# EAGLE design riffle-CTL-0.2-dip (EAGLE 7.3.0)
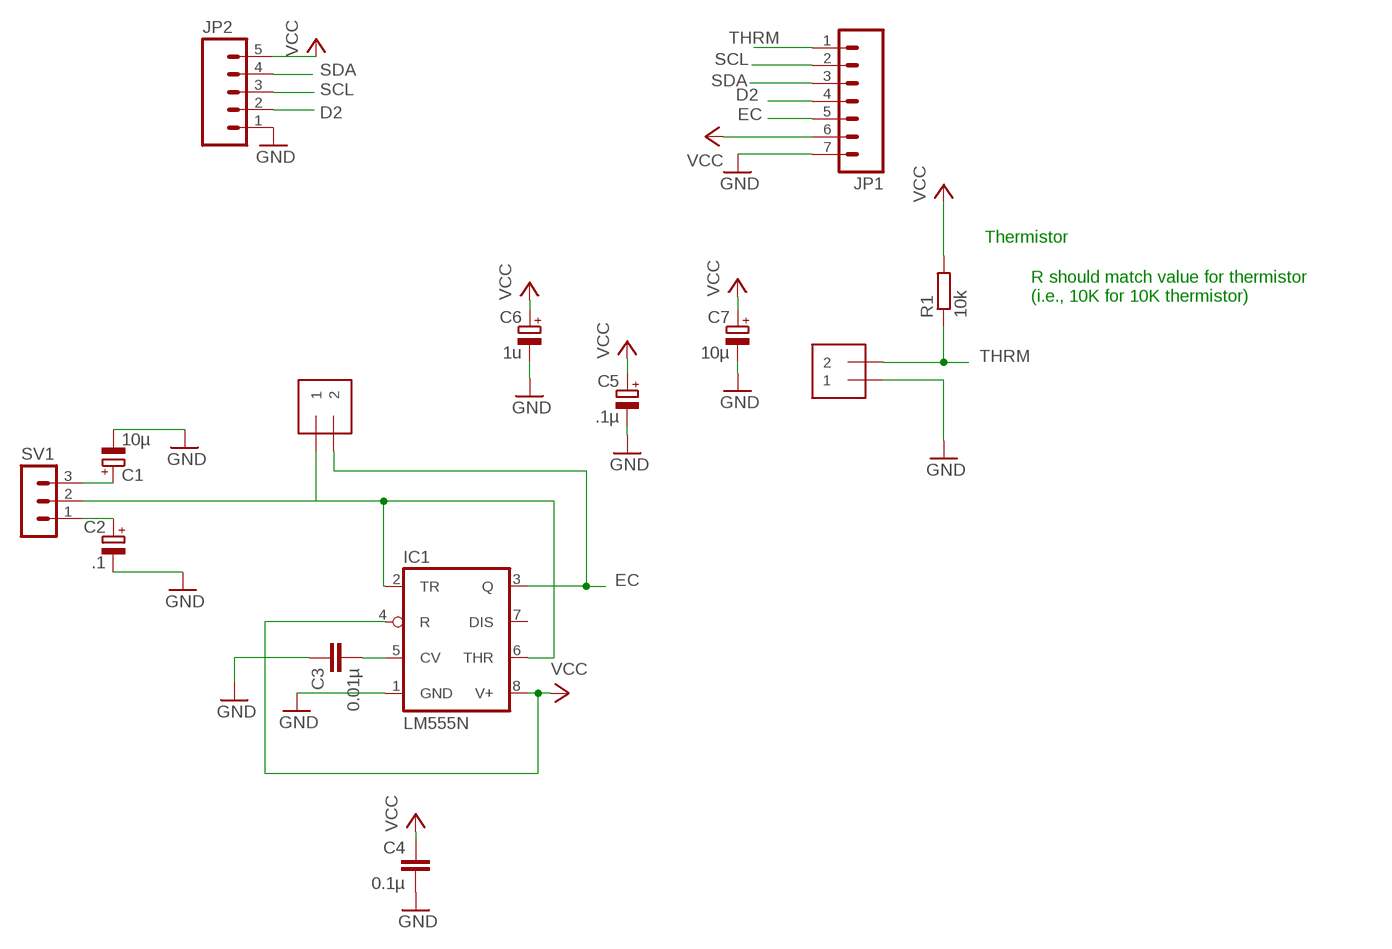
[diagram p0: schematic, sheet 1]

## Parts
C1  10µ  CPOL-EUE1.8-4  [E1,8-4]
C2  .1  CPOL-EUE1.8-4  [E1,8-4]
C3  0.01µ  C-EU025-024X044  [C025-024X044]
C4  0.1µ  C-EU025-024X044  [C025-024X044]
C5  .1µ  CPOL-EUE1.8-4  [E1,8-4]
C6  1u  CPOL-EUE1.8-4  [E1,8-4]
C7  10µ  CPOL-EUE1.8-4  [E1,8-4]
EC1  1X2-3.5MM  [1X2-3.5MM]
IC1  LM555N  [DIL08]
JP1  M07  [1X07]
JP2  M05PTH  [1X05]
R1  10k  R-EU_0204/7  [0204/7]
SV1  MA03-1  [MA03-1]
THRM  1X2-3.5MM  [1X2-3.5MM]

## Nets
D2: JP1.4 JP2.2
EC: EC1.2 IC1.3(Q) JP1.5
GND: C1.- C2.- C3.1 C4.2 C5.- C6.- C7.- IC1.1(GND) JP1.7 JP2.1 THRM.1
N$1: C1.+ SV1.3
N$3: EC1.1 IC1.2(TR) IC1.6(THR) SV1.2
N$4: C2.+ SV1.1
N$7: C3.2 IC1.5(CV)
SCL: JP1.2 JP2.3
SDA: JP1.3 JP2.4
THRM: JP1.1 R1.1 THRM.2
VCC: C4.1 C5.+ C6.+ C7.+ IC1.4(R) IC1.8(V+) JP1.6 JP2.5 R1.2
Unconnected: IC1.7(DIS)

## Notes on the sheet
- Thermistor
- R should match value for thermistor
  (i.e., 10K for 10K thermistor)

## Library data of the parts
C1 C2 C5-C7 = resistor:CPOL-EU: POLARIZED CAPACITOR, European symbol
C3 C4 = resistor:C-EU: CAPACITOR, European symbol
EC1 THRM = adafruit:1X2: 3.5mm Terminal block http://www.ladyada.net/library/pcb/eaglelibrary.html
IC1 = linear:*555: TIMER
JP1 = SparkFun-Connectors:M07: Header 7 Standard 7-pin 0.1" header. Use with straight break away headers (SKU : PRT-00116), right angle break away headers (PRT-00553), swiss pins (PRT-00743), machine pins (PRT-00117), and female headers (PRT-00115). NOTES ON THE VARIANTS LOCK and LOCK_LONGPADS... This footprint was designed to help hold the alignment of a through-hole component (i.e. 7-pin header) while soldering it into place. You may notice that each hole has been shifted either up or down by 0.005 of an inch from it's more standard position (which is usually a perfectly straight line). This slight alteration caused the pins (the squares in the middle) to touch the edges of the holes. Because they are alternating, it causes a "brace" to hold the header in place. 0.005 has proven to be the perfect amount of "off-center" position when using our standard breakaway headers. Although looks a little odd when you look at the bare footprint, once you have a header in there, the alteration is very hard to notice. Also, if you push a header all the way into place, it is covered up entirely on the bottom side. This idea of altering the position of holes to aid alignment will be further integrated into the Sparkfun Library for other footprints. It can help hold any component with 3 or more connection pins.
JP2 = SparkFun-Connectors:M05: Header 5 Standard 5-pin 0.1" header. Use with straight break away headers (SKU : PRT-00116), right angle break away headers (PRT-00553), swiss pins (PRT-00743), machine pins (PRT-00117), and female headers (PRT-00115). Molex polarized connector foot print use with SKU : PRT-08230 with associated crimp pins and housings.
R1 = resistor:R-EU_: RESISTOR, European symbol
SV1 = con-lstb:MA03-1: PIN HEADER; OC_FARNELL: unknown; OC_NEWARK: unknown

## Net classes
0 default: width 0.203 mm, drill 0.33 mm, clearance 0.203 mm
1 power: width 0.381 mm, clearance 0.254 mm

## Board
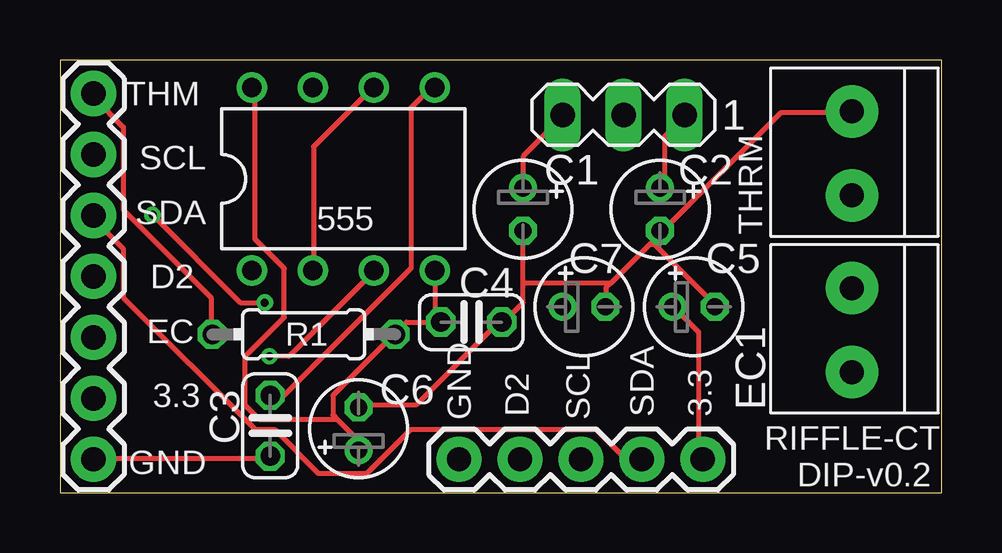
[diagram p1: board, top side]
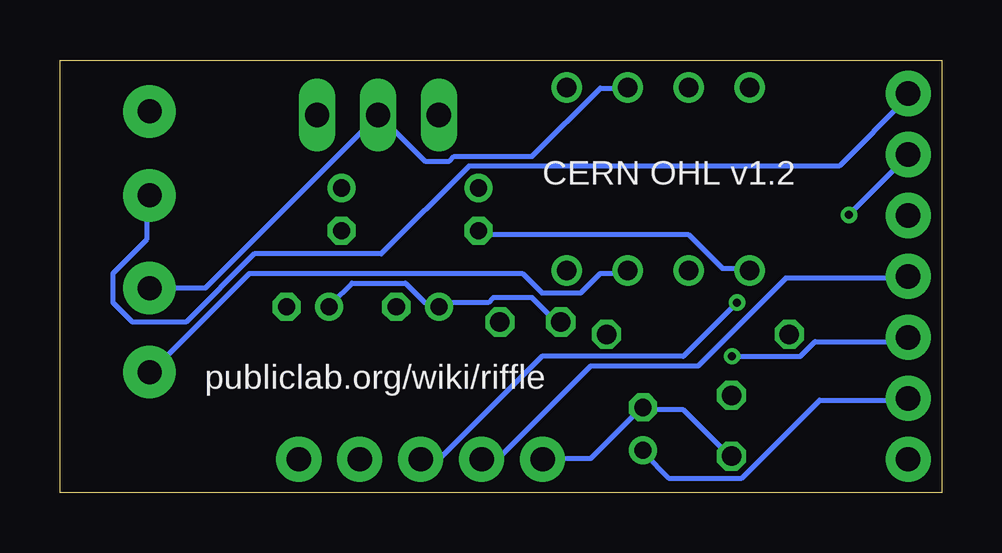
[diagram p2: board, bottom side, seen from below]

Size 36.75 x 18.02 mm. Coordinates in mm from the lower left corner, seen from the top.
Outline: 0,0 36.75,0 36.75,18.02 0,18.02 0,0
Copper layers (1*16): Top 0.0356mm / dielectric 1.5011mm / Bottom 0.0356mm
Design rules "LaenPCBOrder": minimum track width 6mil, minimum drill 13mil, track to track 6mil, track to pad 6mil, pad to pad 6mil, via to via 6mil, smd to smd 6mil, copper to edge 15mil, drill to drill 6mil, minimum pad ring 7mil, minimum via ring 7mil, stop-mask expansion 3mil, vias tented up to drill 0mil, thermal gap 10mil

### Footprints (pad centres in the part's own frame; a part is rotated, then mirrored left to right if it is on the bottom)
E1,8-4 = drill 0.711 pad 1.168: + -0.889,0 | drill 0.711 pad 1.168 octagon: - 0.889,0
C025-024X044 = drill 0.813 octagon: 1 -1.27,0; 2 1.27,0
1X2-3.5MM = drill 1 pad 2.184: 1 1.8,0; 2 -1.7,0
DIL08 = drill 0.813 pad 1.27: 1 -3.81,-3.81; 2 -1.27,-3.81; 3 1.27,-3.81; 4 3.81,-3.81; 5 3.81,3.81; 6 1.27,3.81; 7 -1.27,3.81; 8 -3.81,3.81
1X07 = drill 1.016 pad 1.88: 1 0,0; 2 2.54,0; 3 5.08,0; 4 7.62,0; 5 10.16,0; 6 12.7,0; 7 15.24,0
1X05 = drill 1.016 pad 1.88: 1 0,0; 2 2.54,0; 3 5.08,0; 4 7.62,0; 5 10.16,0
0204/7 = drill 0.813 octagon: 1 -3.81,0; 2 3.81,0
MA03-1 = drill 1.016 long: 1 -2.54,0; 2 0,0; 3 2.54,0

### Placement (x,y rotation side)
C1  19.3,11.81 270 top
C2  25.02,11.81 270 top
C3  8.76,2.79 90 top
C4  17.14,7.11 0 top
C5  26.42,7.75 0 top
C6  12.45,2.67 90 top
C7  21.84,7.75 0 top
EC1  33.02,6.73 90 top
IC1  11.81,13.08 0 top
JP1  1.4,16.64 270 top
JP2  16.64,1.4 0 top
R1  10.16,6.6 0 top
SV1  23.5,15.75 180 top
THRM  33.02,14.1 90 top

### Tracks (layer width: path | path; a pad name or v marks a point on that pad's centre or on a via)
D2
  Bottom 0.203: JP2.2 19.1,1.42 18.49,1.42 14.63,5.28 10.16,5.28 6.5,8.94 1.42,8.94 JP1.4
EC  (via drill 0.33)
  Top 0.203: v8.74,5.69 9.55,5.69 13.01,9.14 IC1.3
  Bottom 0.203: IC1.3 13.21,9.14 14.22,9.14 15.04,8.33 16.66,8.33 17.48,9.14 28.85,9.14 32.92,5.08 EC1.2 | v8.74,5.69 5.89,5.69 5.28,6.3 1.42,6.3 JP1.5
GND
  Top 0.203: JP1.7 1.42,1.42 8.74,1.42 C3.1 | 19.3,8.74 19.3,7.92 18.49,7.11 C4.2 18.29,7.11 14.83,3.66 12.6,3.66 C6.- | 19.3,8.74 C1.- | 24.59,10.36 24.99,10.77 C2.- 25.2,10.97 30.07,15.85 32.92,15.85 THRM.1 | 24.59,10.36 22.96,8.74 | 22.96,8.74 22.76,8.53 22.76,7.92 C7.- | 24.59,10.36 24.79,10.36 27.23,7.92 C5.- | 22.96,8.74 19.3,8.74
  Bottom 0.203: C3.1 8.94,1.63 10.77,3.45 12.39,3.45 C6.- 12.6,3.45 14.63,1.42 16.46,1.42 JP2.1 | IC1.1 8.13,9.35 9.14,9.35 10.57,10.77 19.3,10.77 C1.-
N$1
  Top 0.203: C1.+ 19.3,14.02 20.93,15.65 SV1.3
N$3
  Top 0.203: IC1.2 10.57,9.35 10.57,14.43 13.01,16.87 IC1.6
  Bottom 0.203: EC1.1 32.92,8.53 30.68,8.53 23.57,15.65 SV1.2 23.37,15.65 21.54,13.82 20.52,13.82 20.32,14.02 17.07,14.02 14.22,16.87 13.21,16.87 IC1.6
N$4
  Top 0.203: C2.+ 25.2,12.8 25.2,14.83 26.01,15.65 SV1.1
N$7
  Top 0.203: C3.2 9.35,4.06 14.63,9.35 14.63,16.05 15.44,16.87 IC1.5
SCL  (via drill 0.33)
  Top 0.203: v8.53,7.92 7.52,7.92 v3.86,11.58
  Bottom 0.203: v8.53,7.92 10.77,5.69 16.66,5.69 20.93,1.42 21.54,1.42 JP2.3 | v3.86,11.58 1.42,14.02 JP1.2
SDA
  Top 0.203: JP2.4 24.18,1.42 23.57,1.42 22.35,2.64 14.63,2.64 12.8,0.81 10.77,0.81 8.94,2.64 8.13,2.64 2.64,8.13 2.64,10.16 1.42,11.38 JP1.3
THRM
  Top 0.203: R1.1 6.3,6.71 6.3,8.13 2.64,11.79 2.64,15.24 1.42,16.46 JP1.1
  Bottom 0.203: THRM.2 33.12,12.39 33.12,10.57 34.54,9.14 34.54,7.92 33.73,7.11 31.5,7.11 28.65,9.96 23.37,9.96 19.71,13.61 4.27,13.61 1.42,16.46 JP1.1
VCC
  Top 0.203: JP2.5 26.62,1.42 26.62,6.71 25.6,7.72 C5.+ | 11.58,3.05 11.38,3.25 11.38,4.06 13.82,6.5 R1.2 14.02,6.71 14.43,7.11 15.65,7.11 | 11.58,3.05 12.39,2.23 12.39,1.83 C6.+ | 15.65,7.11 C4.1 15.85,7.11 | 15.65,7.11 15.65,9.14 IC1.4 | 11.58,3.05 8.33,3.05 7.72,3.66 7.72,5.69 9.35,7.32 9.35,9.35 8.13,10.57 8.13,16.87 IC1.8
  Bottom 0.203: C5.+ 25.4,7.92 24.59,8.74 22.35,8.74 21.54,7.92 21.13,7.92 C7.+ 20.93,7.92 18.9,7.92 18.69,8.13 17.07,8.13 16.05,7.11 C4.1 | JP1.6 1.42,3.86 5.08,3.86 8.33,0.61 11.38,0.61 12.39,1.63 C6.+

### Text on the board
tPlace: THM | SCL | SDA | 555 | D2 | EC | 3.3 | GND | D2 | SCL | SDA | 3.3 | RIFFLE-CT | GND | DIP-v0.2
bPlace: CERN OHL v1.2 | publiclab.org/wiki/riffle